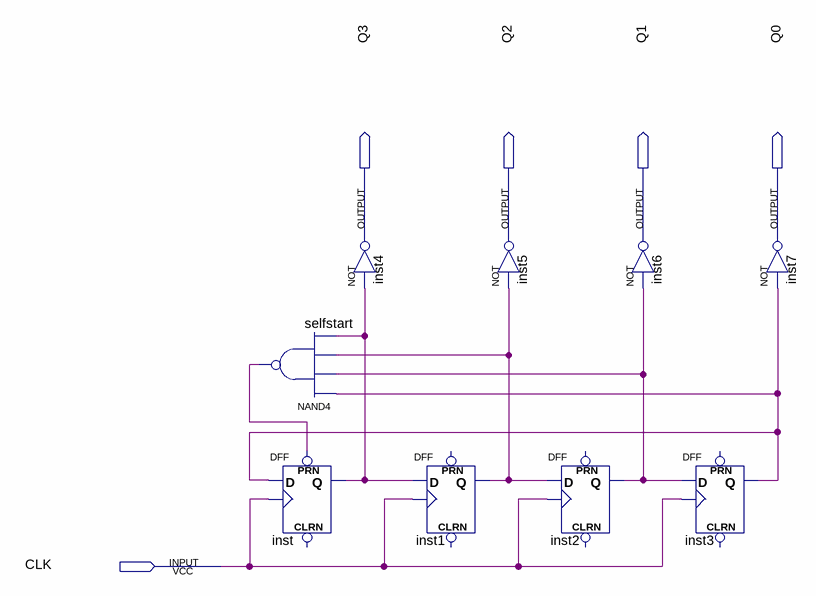
[diagram p0: schematic sheet]
// Quartus schematic RingCounter.bdf as structural Verilog: 9 symbols, 5 pins
module RingCounter (
  input  CLK,
  output Q3,
  output Q2,
  output Q1,
  output Q0
);

  wire inst1_q, inst2_q, inst3_q, inst_q, selfstart_out;

  nand selfstart (selfstart_out, inst3_q, inst2_q, inst1_q, inst_q);
  DFF inst (.CLK(CLK), .D(inst3_q), .PRN(selfstart_out), .Q(inst_q));  // open: CLRN
  not inst4 (Q3, inst_q);
  DFF inst1 (.CLK(CLK), .D(inst_q), .Q(inst1_q));  // open: CLRN, PRN
  not inst5 (Q2, inst1_q);
  DFF inst2 (.CLK(CLK), .D(inst1_q), .Q(inst2_q));  // open: CLRN, PRN
  not inst6 (Q1, inst2_q);
  DFF inst3 (.CLK(CLK), .D(inst2_q), .Q(inst3_q));  // open: CLRN, PRN
  not inst7 (Q0, inst3_q);
endmodule
